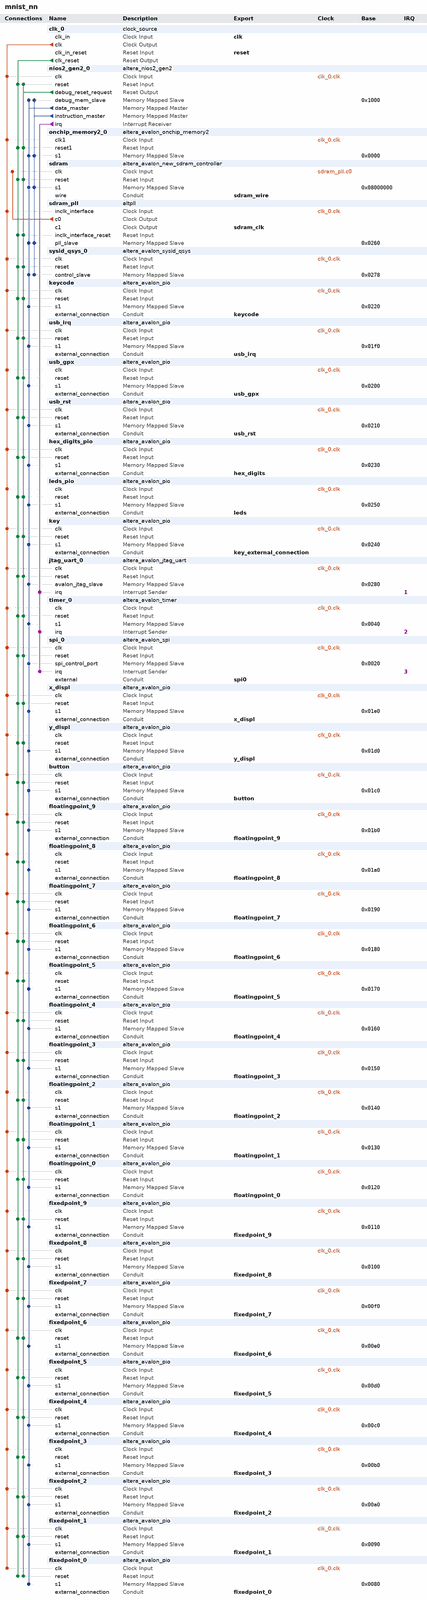
[diagram p0: system contents, whole]
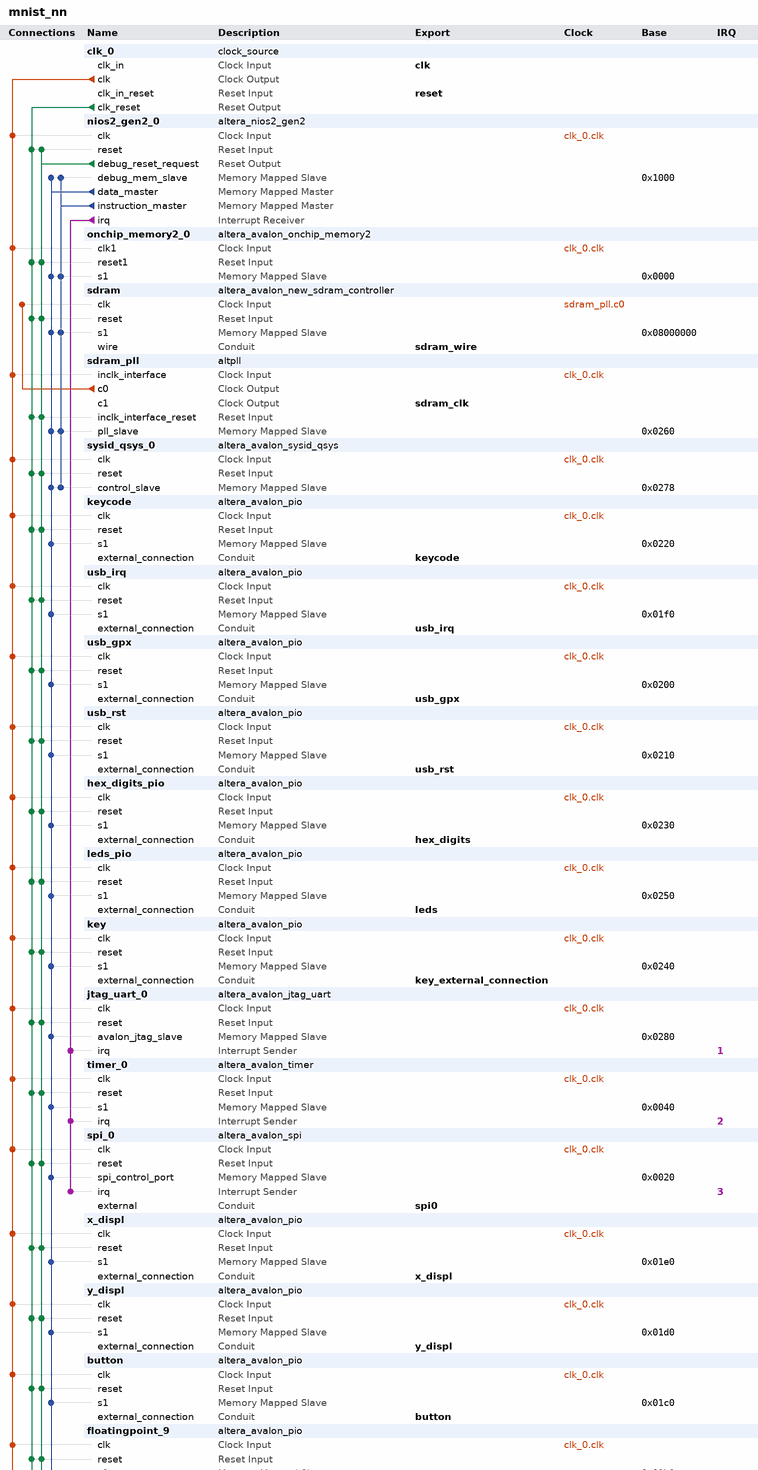
[diagram p1: system contents, upper part]
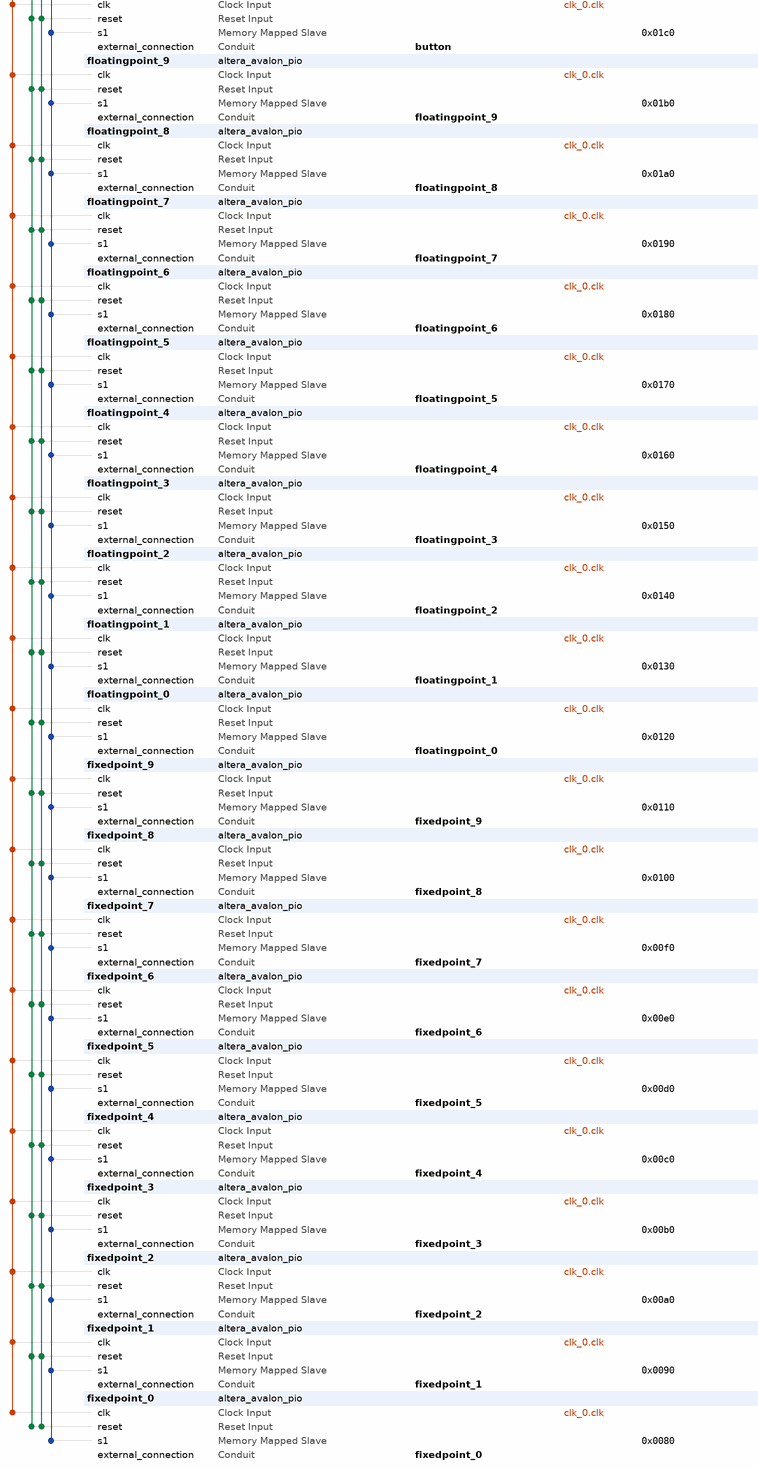
[diagram p2: system contents, lower part]
# Platform Designer (Qsys) system mnist_nn, MAX 10 10M50DAF484C7G
# Parameters at their usual value, and those the tool derives, are not listed.
package require -exact qsys 18.1
create_system mnist_nn
set_project_property DEVICE_FAMILY {MAX 10}
set_project_property DEVICE 10M50DAF484C7G

add_instance clk_0 clock_source 18.1
set_instance_parameter_value clk_0 clockFrequency 50000000

add_instance nios2_gen2_0 altera_nios2_gen2 18.1
set_instance_parameter_value nios2_gen2_0 dcache_size 2048
set_instance_parameter_value nios2_gen2_0 exceptionSlave sdram.s1
set_instance_parameter_value nios2_gen2_0 icache_size 4096
set_instance_parameter_value nios2_gen2_0 impl Tiny
set_instance_parameter_value nios2_gen2_0 resetSlave sdram.s1

add_instance onchip_memory2_0 altera_avalon_onchip_memory2 18.1
set_instance_parameter_value onchip_memory2_0 dataWidth 32
set_instance_parameter_value onchip_memory2_0 dualPort false
set_instance_parameter_value onchip_memory2_0 initMemContent true
set_instance_parameter_value onchip_memory2_0 initializationFileName onchip_mem.hex
set_instance_parameter_value onchip_memory2_0 memorySize 16

add_instance sdram altera_avalon_new_sdram_controller 18.1
set_instance_parameter_value sdram TAC 5.4
set_instance_parameter_value sdram TRCD 20.0
set_instance_parameter_value sdram TRP 20.0
set_instance_parameter_value sdram casLatency 3
set_instance_parameter_value sdram columnWidth 10
set_instance_parameter_value sdram dataWidth 16
set_instance_parameter_value sdram generateSimulationModel false
set_instance_parameter_value sdram model single_Micron_MT48LC4M32B2_7_chip
set_instance_parameter_value sdram numberOfBanks 4
set_instance_parameter_value sdram numberOfChipSelects 1
set_instance_parameter_value sdram powerUpDelay 200.0
set_instance_parameter_value sdram refreshPeriod 15.625
set_instance_parameter_value sdram rowWidth 13

add_instance sdram_pll altpll 18.1
set_instance_parameter_value sdram_pll CLK0_DIVIDE_BY 1
set_instance_parameter_value sdram_pll CLK0_MULTIPLY_BY 1
set_instance_parameter_value sdram_pll CLK1_DIVIDE_BY 1
set_instance_parameter_value sdram_pll CLK1_DUTY_CYCLE 50
set_instance_parameter_value sdram_pll CLK1_MULTIPLY_BY 1
set_instance_parameter_value sdram_pll CLK1_PHASE_SHIFT -1000
set_instance_parameter_value sdram_pll INCLK0_INPUT_FREQUENCY 20000
set_instance_parameter_value sdram_pll PORT_ARESET PORT_UNUSED
set_instance_parameter_value sdram_pll PORT_LOCKED PORT_UNUSED
set_instance_parameter_value sdram_pll PORT_clk1 PORT_USED
set_instance_parameter_value sdram_pll PORT_clk2 PORT_UNUSED
set_instance_parameter_value sdram_pll PORT_clk3 PORT_UNUSED

add_instance sysid_qsys_0 altera_avalon_sysid_qsys 18.1
set_instance_parameter_value sysid_qsys_0 id 0

add_instance keycode altera_avalon_pio 18.1
set_instance_parameter_value keycode direction Output
set_instance_parameter_value keycode width 8

add_instance usb_irq altera_avalon_pio 18.1
set_instance_parameter_value usb_irq direction Input
set_instance_parameter_value usb_irq width 1

add_instance usb_gpx altera_avalon_pio 18.1
set_instance_parameter_value usb_gpx direction Input
set_instance_parameter_value usb_gpx width 1

add_instance usb_rst altera_avalon_pio 18.1
set_instance_parameter_value usb_rst direction Output
set_instance_parameter_value usb_rst width 1

add_instance hex_digits_pio altera_avalon_pio 18.1
set_instance_parameter_value hex_digits_pio direction Output
set_instance_parameter_value hex_digits_pio width 16

add_instance leds_pio altera_avalon_pio 18.1
set_instance_parameter_value leds_pio direction Output
set_instance_parameter_value leds_pio width 14

add_instance key altera_avalon_pio 18.1
set_instance_parameter_value key direction Input
set_instance_parameter_value key width 2

add_instance jtag_uart_0 altera_avalon_jtag_uart 18.1
set_instance_parameter_value jtag_uart_0 simInteractiveOptions NO_INTERACTIVE_WINDOWS

add_instance timer_0 altera_avalon_timer 18.1
set_instance_parameter_value timer_0 counterSize 64
set_instance_parameter_value timer_0 period 1
set_instance_parameter_value timer_0 periodUnits MSEC

add_instance spi_0 altera_avalon_spi 18.1
set_instance_parameter_value spi_0 clockPolarity 0
set_instance_parameter_value spi_0 dataWidth 8
set_instance_parameter_value spi_0 masterSPI true
set_instance_parameter_value spi_0 numberOfSlaves 1
set_instance_parameter_value spi_0 targetClockRate 2500000

add_instance x_displ altera_avalon_pio 18.1
set_instance_parameter_value x_displ direction Output
set_instance_parameter_value x_displ width 8

add_instance y_displ altera_avalon_pio 18.1
set_instance_parameter_value y_displ direction Output
set_instance_parameter_value y_displ width 8

add_instance button altera_avalon_pio 18.1
set_instance_parameter_value button direction Output
set_instance_parameter_value button width 8

add_instance floatingpoint_9 altera_avalon_pio 18.1
set_instance_parameter_value floatingpoint_9 direction Output
set_instance_parameter_value floatingpoint_9 width 16

add_instance floatingpoint_8 altera_avalon_pio 18.1
set_instance_parameter_value floatingpoint_8 direction Output
set_instance_parameter_value floatingpoint_8 width 16

add_instance floatingpoint_7 altera_avalon_pio 18.1
set_instance_parameter_value floatingpoint_7 direction Output
set_instance_parameter_value floatingpoint_7 width 16

add_instance floatingpoint_6 altera_avalon_pio 18.1
set_instance_parameter_value floatingpoint_6 direction Output
set_instance_parameter_value floatingpoint_6 width 16

add_instance floatingpoint_5 altera_avalon_pio 18.1
set_instance_parameter_value floatingpoint_5 direction Output
set_instance_parameter_value floatingpoint_5 width 16

add_instance floatingpoint_4 altera_avalon_pio 18.1
set_instance_parameter_value floatingpoint_4 direction Output
set_instance_parameter_value floatingpoint_4 width 16

add_instance floatingpoint_3 altera_avalon_pio 18.1
set_instance_parameter_value floatingpoint_3 direction Output
set_instance_parameter_value floatingpoint_3 width 16

add_instance floatingpoint_2 altera_avalon_pio 18.1
set_instance_parameter_value floatingpoint_2 direction Output
set_instance_parameter_value floatingpoint_2 width 16

add_instance floatingpoint_1 altera_avalon_pio 18.1
set_instance_parameter_value floatingpoint_1 direction Output
set_instance_parameter_value floatingpoint_1 width 16

add_instance floatingpoint_0 altera_avalon_pio 18.1
set_instance_parameter_value floatingpoint_0 direction Output
set_instance_parameter_value floatingpoint_0 width 16

add_instance fixedpoint_9 altera_avalon_pio 18.1
set_instance_parameter_value fixedpoint_9 direction Input
set_instance_parameter_value fixedpoint_9 width 16

add_instance fixedpoint_8 altera_avalon_pio 18.1
set_instance_parameter_value fixedpoint_8 direction Input
set_instance_parameter_value fixedpoint_8 width 16

add_instance fixedpoint_7 altera_avalon_pio 18.1
set_instance_parameter_value fixedpoint_7 direction Input
set_instance_parameter_value fixedpoint_7 width 16

add_instance fixedpoint_6 altera_avalon_pio 18.1
set_instance_parameter_value fixedpoint_6 direction Input
set_instance_parameter_value fixedpoint_6 width 16

add_instance fixedpoint_5 altera_avalon_pio 18.1
set_instance_parameter_value fixedpoint_5 direction Input
set_instance_parameter_value fixedpoint_5 width 16

add_instance fixedpoint_4 altera_avalon_pio 18.1
set_instance_parameter_value fixedpoint_4 direction Input
set_instance_parameter_value fixedpoint_4 width 16

add_instance fixedpoint_3 altera_avalon_pio 18.1
set_instance_parameter_value fixedpoint_3 direction Input
set_instance_parameter_value fixedpoint_3 width 16

add_instance fixedpoint_2 altera_avalon_pio 18.1
set_instance_parameter_value fixedpoint_2 direction Input
set_instance_parameter_value fixedpoint_2 width 16

add_instance fixedpoint_1 altera_avalon_pio 18.1
set_instance_parameter_value fixedpoint_1 direction Input
set_instance_parameter_value fixedpoint_1 width 16

add_instance fixedpoint_0 altera_avalon_pio 18.1
set_instance_parameter_value fixedpoint_0 direction Input
set_instance_parameter_value fixedpoint_0 width 16

# connections
add_connection clk_0.clk button.clk clock
add_connection clk_0.clk fixedpoint_0.clk clock
add_connection clk_0.clk fixedpoint_1.clk clock
add_connection clk_0.clk fixedpoint_2.clk clock
add_connection clk_0.clk fixedpoint_3.clk clock
add_connection clk_0.clk fixedpoint_4.clk clock
add_connection clk_0.clk fixedpoint_5.clk clock
add_connection clk_0.clk fixedpoint_6.clk clock
add_connection clk_0.clk fixedpoint_7.clk clock
add_connection clk_0.clk fixedpoint_8.clk clock
add_connection clk_0.clk fixedpoint_9.clk clock
add_connection clk_0.clk floatingpoint_0.clk clock
add_connection clk_0.clk floatingpoint_1.clk clock
add_connection clk_0.clk floatingpoint_2.clk clock
add_connection clk_0.clk floatingpoint_3.clk clock
add_connection clk_0.clk floatingpoint_4.clk clock
add_connection clk_0.clk floatingpoint_5.clk clock
add_connection clk_0.clk floatingpoint_6.clk clock
add_connection clk_0.clk floatingpoint_7.clk clock
add_connection clk_0.clk floatingpoint_8.clk clock
add_connection clk_0.clk floatingpoint_9.clk clock
add_connection clk_0.clk hex_digits_pio.clk clock
add_connection clk_0.clk jtag_uart_0.clk clock
add_connection clk_0.clk key.clk clock
add_connection clk_0.clk keycode.clk clock
add_connection clk_0.clk leds_pio.clk clock
add_connection clk_0.clk nios2_gen2_0.clk clock
add_connection clk_0.clk onchip_memory2_0.clk1 clock
add_connection clk_0.clk sdram_pll.inclk_interface clock
add_connection clk_0.clk spi_0.clk clock
add_connection clk_0.clk sysid_qsys_0.clk clock
add_connection clk_0.clk timer_0.clk clock
add_connection clk_0.clk usb_gpx.clk clock
add_connection clk_0.clk usb_irq.clk clock
add_connection clk_0.clk usb_rst.clk clock
add_connection clk_0.clk x_displ.clk clock
add_connection clk_0.clk y_displ.clk clock
add_connection sdram_pll.c0 sdram.clk clock
add_connection clk_0.clk_reset button.reset reset
add_connection clk_0.clk_reset fixedpoint_0.reset reset
add_connection clk_0.clk_reset fixedpoint_1.reset reset
add_connection clk_0.clk_reset fixedpoint_2.reset reset
add_connection clk_0.clk_reset fixedpoint_3.reset reset
add_connection clk_0.clk_reset fixedpoint_4.reset reset
add_connection clk_0.clk_reset fixedpoint_5.reset reset
add_connection clk_0.clk_reset fixedpoint_6.reset reset
add_connection clk_0.clk_reset fixedpoint_7.reset reset
add_connection clk_0.clk_reset fixedpoint_8.reset reset
add_connection clk_0.clk_reset fixedpoint_9.reset reset
add_connection clk_0.clk_reset floatingpoint_0.reset reset
add_connection clk_0.clk_reset floatingpoint_1.reset reset
add_connection clk_0.clk_reset floatingpoint_2.reset reset
add_connection clk_0.clk_reset floatingpoint_3.reset reset
add_connection clk_0.clk_reset floatingpoint_4.reset reset
add_connection clk_0.clk_reset floatingpoint_5.reset reset
add_connection clk_0.clk_reset floatingpoint_6.reset reset
add_connection clk_0.clk_reset floatingpoint_7.reset reset
add_connection clk_0.clk_reset floatingpoint_8.reset reset
add_connection clk_0.clk_reset floatingpoint_9.reset reset
add_connection clk_0.clk_reset hex_digits_pio.reset reset
add_connection clk_0.clk_reset jtag_uart_0.reset reset
add_connection clk_0.clk_reset key.reset reset
add_connection clk_0.clk_reset keycode.reset reset
add_connection clk_0.clk_reset leds_pio.reset reset
add_connection clk_0.clk_reset nios2_gen2_0.reset reset
add_connection clk_0.clk_reset onchip_memory2_0.reset1 reset
add_connection clk_0.clk_reset sdram.reset reset
add_connection clk_0.clk_reset sdram_pll.inclk_interface_reset reset
add_connection clk_0.clk_reset spi_0.reset reset
add_connection clk_0.clk_reset sysid_qsys_0.reset reset
add_connection clk_0.clk_reset timer_0.reset reset
add_connection clk_0.clk_reset usb_gpx.reset reset
add_connection clk_0.clk_reset usb_irq.reset reset
add_connection clk_0.clk_reset usb_rst.reset reset
add_connection clk_0.clk_reset x_displ.reset reset
add_connection clk_0.clk_reset y_displ.reset reset
add_connection nios2_gen2_0.debug_reset_request button.reset reset
add_connection nios2_gen2_0.debug_reset_request fixedpoint_0.reset reset
add_connection nios2_gen2_0.debug_reset_request fixedpoint_1.reset reset
add_connection nios2_gen2_0.debug_reset_request fixedpoint_2.reset reset
add_connection nios2_gen2_0.debug_reset_request fixedpoint_3.reset reset
add_connection nios2_gen2_0.debug_reset_request fixedpoint_4.reset reset
add_connection nios2_gen2_0.debug_reset_request fixedpoint_5.reset reset
add_connection nios2_gen2_0.debug_reset_request fixedpoint_6.reset reset
add_connection nios2_gen2_0.debug_reset_request fixedpoint_7.reset reset
add_connection nios2_gen2_0.debug_reset_request fixedpoint_8.reset reset
add_connection nios2_gen2_0.debug_reset_request fixedpoint_9.reset reset
add_connection nios2_gen2_0.debug_reset_request floatingpoint_0.reset reset
add_connection nios2_gen2_0.debug_reset_request floatingpoint_1.reset reset
add_connection nios2_gen2_0.debug_reset_request floatingpoint_2.reset reset
add_connection nios2_gen2_0.debug_reset_request floatingpoint_3.reset reset
add_connection nios2_gen2_0.debug_reset_request floatingpoint_4.reset reset
add_connection nios2_gen2_0.debug_reset_request floatingpoint_5.reset reset
add_connection nios2_gen2_0.debug_reset_request floatingpoint_6.reset reset
add_connection nios2_gen2_0.debug_reset_request floatingpoint_7.reset reset
add_connection nios2_gen2_0.debug_reset_request floatingpoint_8.reset reset
add_connection nios2_gen2_0.debug_reset_request floatingpoint_9.reset reset
add_connection nios2_gen2_0.debug_reset_request hex_digits_pio.reset reset
add_connection nios2_gen2_0.debug_reset_request jtag_uart_0.reset reset
add_connection nios2_gen2_0.debug_reset_request key.reset reset
add_connection nios2_gen2_0.debug_reset_request keycode.reset reset
add_connection nios2_gen2_0.debug_reset_request leds_pio.reset reset
add_connection nios2_gen2_0.debug_reset_request nios2_gen2_0.reset reset
add_connection nios2_gen2_0.debug_reset_request onchip_memory2_0.reset1 reset
add_connection nios2_gen2_0.debug_reset_request sdram.reset reset
add_connection nios2_gen2_0.debug_reset_request sdram_pll.inclk_interface_reset reset
add_connection nios2_gen2_0.debug_reset_request spi_0.reset reset
add_connection nios2_gen2_0.debug_reset_request sysid_qsys_0.reset reset
add_connection nios2_gen2_0.debug_reset_request timer_0.reset reset
add_connection nios2_gen2_0.debug_reset_request usb_gpx.reset reset
add_connection nios2_gen2_0.debug_reset_request usb_irq.reset reset
add_connection nios2_gen2_0.debug_reset_request usb_rst.reset reset
add_connection nios2_gen2_0.debug_reset_request x_displ.reset reset
add_connection nios2_gen2_0.debug_reset_request y_displ.reset reset
add_connection nios2_gen2_0.data_master button.s1 avalon
set_connection_parameter_value nios2_gen2_0.data_master/button.s1 baseAddress 0x01c0
add_connection nios2_gen2_0.data_master fixedpoint_0.s1 avalon
set_connection_parameter_value nios2_gen2_0.data_master/fixedpoint_0.s1 baseAddress 0x0080
add_connection nios2_gen2_0.data_master fixedpoint_1.s1 avalon
set_connection_parameter_value nios2_gen2_0.data_master/fixedpoint_1.s1 baseAddress 0x0090
add_connection nios2_gen2_0.data_master fixedpoint_2.s1 avalon
set_connection_parameter_value nios2_gen2_0.data_master/fixedpoint_2.s1 baseAddress 0x00a0
add_connection nios2_gen2_0.data_master fixedpoint_3.s1 avalon
set_connection_parameter_value nios2_gen2_0.data_master/fixedpoint_3.s1 baseAddress 0x00b0
add_connection nios2_gen2_0.data_master fixedpoint_4.s1 avalon
set_connection_parameter_value nios2_gen2_0.data_master/fixedpoint_4.s1 baseAddress 0x00c0
add_connection nios2_gen2_0.data_master fixedpoint_5.s1 avalon
set_connection_parameter_value nios2_gen2_0.data_master/fixedpoint_5.s1 baseAddress 0x00d0
add_connection nios2_gen2_0.data_master fixedpoint_6.s1 avalon
set_connection_parameter_value nios2_gen2_0.data_master/fixedpoint_6.s1 baseAddress 0x00e0
add_connection nios2_gen2_0.data_master fixedpoint_7.s1 avalon
set_connection_parameter_value nios2_gen2_0.data_master/fixedpoint_7.s1 baseAddress 0x00f0
add_connection nios2_gen2_0.data_master fixedpoint_8.s1 avalon
set_connection_parameter_value nios2_gen2_0.data_master/fixedpoint_8.s1 baseAddress 0x0100
add_connection nios2_gen2_0.data_master fixedpoint_9.s1 avalon
set_connection_parameter_value nios2_gen2_0.data_master/fixedpoint_9.s1 baseAddress 0x0110
add_connection nios2_gen2_0.data_master floatingpoint_0.s1 avalon
set_connection_parameter_value nios2_gen2_0.data_master/floatingpoint_0.s1 baseAddress 0x0120
add_connection nios2_gen2_0.data_master floatingpoint_1.s1 avalon
set_connection_parameter_value nios2_gen2_0.data_master/floatingpoint_1.s1 baseAddress 0x0130
add_connection nios2_gen2_0.data_master floatingpoint_2.s1 avalon
set_connection_parameter_value nios2_gen2_0.data_master/floatingpoint_2.s1 baseAddress 0x0140
add_connection nios2_gen2_0.data_master floatingpoint_3.s1 avalon
set_connection_parameter_value nios2_gen2_0.data_master/floatingpoint_3.s1 baseAddress 0x0150
add_connection nios2_gen2_0.data_master floatingpoint_4.s1 avalon
set_connection_parameter_value nios2_gen2_0.data_master/floatingpoint_4.s1 baseAddress 0x0160
add_connection nios2_gen2_0.data_master floatingpoint_5.s1 avalon
set_connection_parameter_value nios2_gen2_0.data_master/floatingpoint_5.s1 baseAddress 0x0170
add_connection nios2_gen2_0.data_master floatingpoint_6.s1 avalon
set_connection_parameter_value nios2_gen2_0.data_master/floatingpoint_6.s1 baseAddress 0x0180
add_connection nios2_gen2_0.data_master floatingpoint_7.s1 avalon
set_connection_parameter_value nios2_gen2_0.data_master/floatingpoint_7.s1 baseAddress 0x0190
add_connection nios2_gen2_0.data_master floatingpoint_8.s1 avalon
set_connection_parameter_value nios2_gen2_0.data_master/floatingpoint_8.s1 baseAddress 0x01a0
add_connection nios2_gen2_0.data_master floatingpoint_9.s1 avalon
set_connection_parameter_value nios2_gen2_0.data_master/floatingpoint_9.s1 baseAddress 0x01b0
add_connection nios2_gen2_0.data_master hex_digits_pio.s1 avalon
set_connection_parameter_value nios2_gen2_0.data_master/hex_digits_pio.s1 baseAddress 0x0230
add_connection nios2_gen2_0.data_master jtag_uart_0.avalon_jtag_slave avalon
set_connection_parameter_value nios2_gen2_0.data_master/jtag_uart_0.avalon_jtag_slave baseAddress 0x0280
add_connection nios2_gen2_0.data_master key.s1 avalon
set_connection_parameter_value nios2_gen2_0.data_master/key.s1 baseAddress 0x0240
add_connection nios2_gen2_0.data_master keycode.s1 avalon
set_connection_parameter_value nios2_gen2_0.data_master/keycode.s1 baseAddress 0x0220
add_connection nios2_gen2_0.data_master leds_pio.s1 avalon
set_connection_parameter_value nios2_gen2_0.data_master/leds_pio.s1 baseAddress 0x0250
add_connection nios2_gen2_0.data_master nios2_gen2_0.debug_mem_slave avalon
set_connection_parameter_value nios2_gen2_0.data_master/nios2_gen2_0.debug_mem_slave baseAddress 0x1000
add_connection nios2_gen2_0.data_master onchip_memory2_0.s1 avalon
set_connection_parameter_value nios2_gen2_0.data_master/onchip_memory2_0.s1 baseAddress 0x0000
add_connection nios2_gen2_0.data_master sdram.s1 avalon
set_connection_parameter_value nios2_gen2_0.data_master/sdram.s1 baseAddress 0x08000000
add_connection nios2_gen2_0.data_master sdram_pll.pll_slave avalon
set_connection_parameter_value nios2_gen2_0.data_master/sdram_pll.pll_slave baseAddress 0x0260
add_connection nios2_gen2_0.data_master spi_0.spi_control_port avalon
set_connection_parameter_value nios2_gen2_0.data_master/spi_0.spi_control_port baseAddress 0x0020
add_connection nios2_gen2_0.data_master sysid_qsys_0.control_slave avalon
set_connection_parameter_value nios2_gen2_0.data_master/sysid_qsys_0.control_slave baseAddress 0x0278
add_connection nios2_gen2_0.data_master timer_0.s1 avalon
set_connection_parameter_value nios2_gen2_0.data_master/timer_0.s1 baseAddress 0x0040
add_connection nios2_gen2_0.data_master usb_gpx.s1 avalon
set_connection_parameter_value nios2_gen2_0.data_master/usb_gpx.s1 baseAddress 0x0200
add_connection nios2_gen2_0.data_master usb_irq.s1 avalon
set_connection_parameter_value nios2_gen2_0.data_master/usb_irq.s1 baseAddress 0x01f0
add_connection nios2_gen2_0.data_master usb_rst.s1 avalon
set_connection_parameter_value nios2_gen2_0.data_master/usb_rst.s1 baseAddress 0x0210
add_connection nios2_gen2_0.data_master x_displ.s1 avalon
set_connection_parameter_value nios2_gen2_0.data_master/x_displ.s1 baseAddress 0x01e0
add_connection nios2_gen2_0.data_master y_displ.s1 avalon
set_connection_parameter_value nios2_gen2_0.data_master/y_displ.s1 baseAddress 0x01d0
add_connection nios2_gen2_0.instruction_master nios2_gen2_0.debug_mem_slave avalon
set_connection_parameter_value nios2_gen2_0.instruction_master/nios2_gen2_0.debug_mem_slave baseAddress 0x1000
add_connection nios2_gen2_0.instruction_master onchip_memory2_0.s1 avalon
set_connection_parameter_value nios2_gen2_0.instruction_master/onchip_memory2_0.s1 baseAddress 0x0000
add_connection nios2_gen2_0.instruction_master sdram.s1 avalon
set_connection_parameter_value nios2_gen2_0.instruction_master/sdram.s1 baseAddress 0x08000000
add_connection nios2_gen2_0.instruction_master sdram_pll.pll_slave avalon
set_connection_parameter_value nios2_gen2_0.instruction_master/sdram_pll.pll_slave baseAddress 0x0260
add_connection nios2_gen2_0.instruction_master sysid_qsys_0.control_slave avalon
set_connection_parameter_value nios2_gen2_0.instruction_master/sysid_qsys_0.control_slave baseAddress 0x0278
add_connection nios2_gen2_0.irq jtag_uart_0.irq interrupt
set_connection_parameter_value nios2_gen2_0.irq/jtag_uart_0.irq irqNumber 1
add_connection nios2_gen2_0.irq spi_0.irq interrupt
set_connection_parameter_value nios2_gen2_0.irq/spi_0.irq irqNumber 3
add_connection nios2_gen2_0.irq timer_0.irq interrupt
set_connection_parameter_value nios2_gen2_0.irq/timer_0.irq irqNumber 2

# exported interfaces
add_interface button conduit end
set_interface_property button EXPORT_OF button.external_connection
add_interface clk clock sink
set_interface_property clk EXPORT_OF clk_0.clk_in
add_interface fixedpoint_0 conduit end
set_interface_property fixedpoint_0 EXPORT_OF fixedpoint_0.external_connection
add_interface fixedpoint_1 conduit end
set_interface_property fixedpoint_1 EXPORT_OF fixedpoint_1.external_connection
add_interface fixedpoint_2 conduit end
set_interface_property fixedpoint_2 EXPORT_OF fixedpoint_2.external_connection
add_interface fixedpoint_3 conduit end
set_interface_property fixedpoint_3 EXPORT_OF fixedpoint_3.external_connection
add_interface fixedpoint_4 conduit end
set_interface_property fixedpoint_4 EXPORT_OF fixedpoint_4.external_connection
add_interface fixedpoint_5 conduit end
set_interface_property fixedpoint_5 EXPORT_OF fixedpoint_5.external_connection
add_interface fixedpoint_6 conduit end
set_interface_property fixedpoint_6 EXPORT_OF fixedpoint_6.external_connection
add_interface fixedpoint_7 conduit end
set_interface_property fixedpoint_7 EXPORT_OF fixedpoint_7.external_connection
add_interface fixedpoint_8 conduit end
set_interface_property fixedpoint_8 EXPORT_OF fixedpoint_8.external_connection
add_interface fixedpoint_9 conduit end
set_interface_property fixedpoint_9 EXPORT_OF fixedpoint_9.external_connection
add_interface floatingpoint_0 conduit end
set_interface_property floatingpoint_0 EXPORT_OF floatingpoint_0.external_connection
add_interface floatingpoint_1 conduit end
set_interface_property floatingpoint_1 EXPORT_OF floatingpoint_1.external_connection
add_interface floatingpoint_2 conduit end
set_interface_property floatingpoint_2 EXPORT_OF floatingpoint_2.external_connection
add_interface floatingpoint_3 conduit end
set_interface_property floatingpoint_3 EXPORT_OF floatingpoint_3.external_connection
add_interface floatingpoint_4 conduit end
set_interface_property floatingpoint_4 EXPORT_OF floatingpoint_4.external_connection
add_interface floatingpoint_5 conduit end
set_interface_property floatingpoint_5 EXPORT_OF floatingpoint_5.external_connection
add_interface floatingpoint_6 conduit end
set_interface_property floatingpoint_6 EXPORT_OF floatingpoint_6.external_connection
add_interface floatingpoint_7 conduit end
set_interface_property floatingpoint_7 EXPORT_OF floatingpoint_7.external_connection
add_interface floatingpoint_8 conduit end
set_interface_property floatingpoint_8 EXPORT_OF floatingpoint_8.external_connection
add_interface floatingpoint_9 conduit end
set_interface_property floatingpoint_9 EXPORT_OF floatingpoint_9.external_connection
add_interface hex_digits conduit end
set_interface_property hex_digits EXPORT_OF hex_digits_pio.external_connection
add_interface key_external_connection conduit end
set_interface_property key_external_connection EXPORT_OF key.external_connection
add_interface keycode conduit end
set_interface_property keycode EXPORT_OF keycode.external_connection
add_interface leds conduit end
set_interface_property leds EXPORT_OF leds_pio.external_connection
add_interface reset reset sink
set_interface_property reset EXPORT_OF clk_0.clk_in_reset
add_interface sdram_clk clock source
set_interface_property sdram_clk EXPORT_OF sdram_pll.c1
add_interface sdram_wire conduit end
set_interface_property sdram_wire EXPORT_OF sdram.wire
add_interface spi0 conduit end
set_interface_property spi0 EXPORT_OF spi_0.external
add_interface usb_gpx conduit end
set_interface_property usb_gpx EXPORT_OF usb_gpx.external_connection
add_interface usb_irq conduit end
set_interface_property usb_irq EXPORT_OF usb_irq.external_connection
add_interface usb_rst conduit end
set_interface_property usb_rst EXPORT_OF usb_rst.external_connection
add_interface x_displ conduit end
set_interface_property x_displ EXPORT_OF x_displ.external_connection
add_interface y_displ conduit end
set_interface_property y_displ EXPORT_OF y_displ.external_connection

set_interconnect_requirement {$system} qsys_mm.clockCrossingAdapter HANDSHAKE
set_interconnect_requirement {$system} qsys_mm.enableEccProtection FALSE
set_interconnect_requirement {$system} qsys_mm.insertDefaultSlave FALSE
set_interconnect_requirement {$system} qsys_mm.maxAdditionalLatency 1

save_system mnist_nn.qsys
